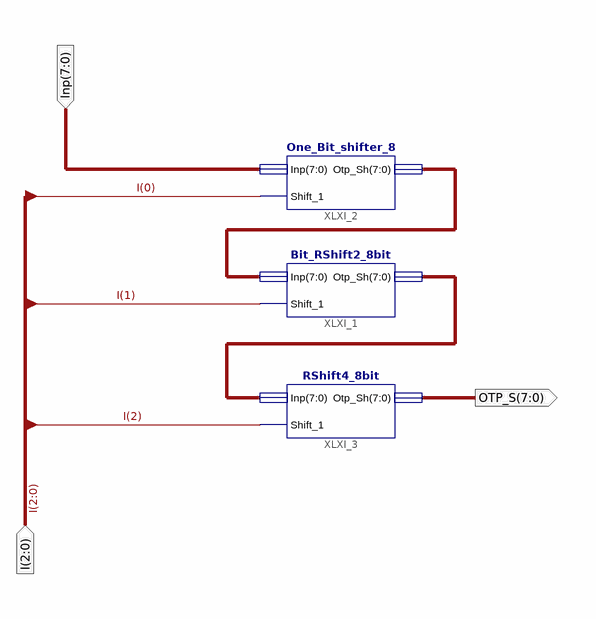
[diagram p0: schematic sheet 1]
// Xilinx ISE schematic I_Bit_Shifer.sch (spartan3e) as structural Verilog: 3 symbols, 3 ports
module I_Bit_Shifer (
  input  [2:0] I,
  input  [7:0] Inp,
  output [7:0] OTP_S
);

  wire [7:0] XLXN_8, XLXN_9;

  Bit_RShift2_8bit XLXI_1 (.Inp(XLXN_8), .Shift_1(I[1]), .Otp_Sh(XLXN_9));
  One_Bit_shifter_8 XLXI_2 (.Inp(Inp), .Shift_1(I[0]), .Otp_Sh(XLXN_8));
  RShift4_8bit XLXI_3 (.Inp(XLXN_9), .Shift_1(I[2]), .Otp_Sh(OTP_S));
endmodule
